# EAGLE schematic Desain Hardware Fahmi Mashuri (EAGLE 9.5.2)
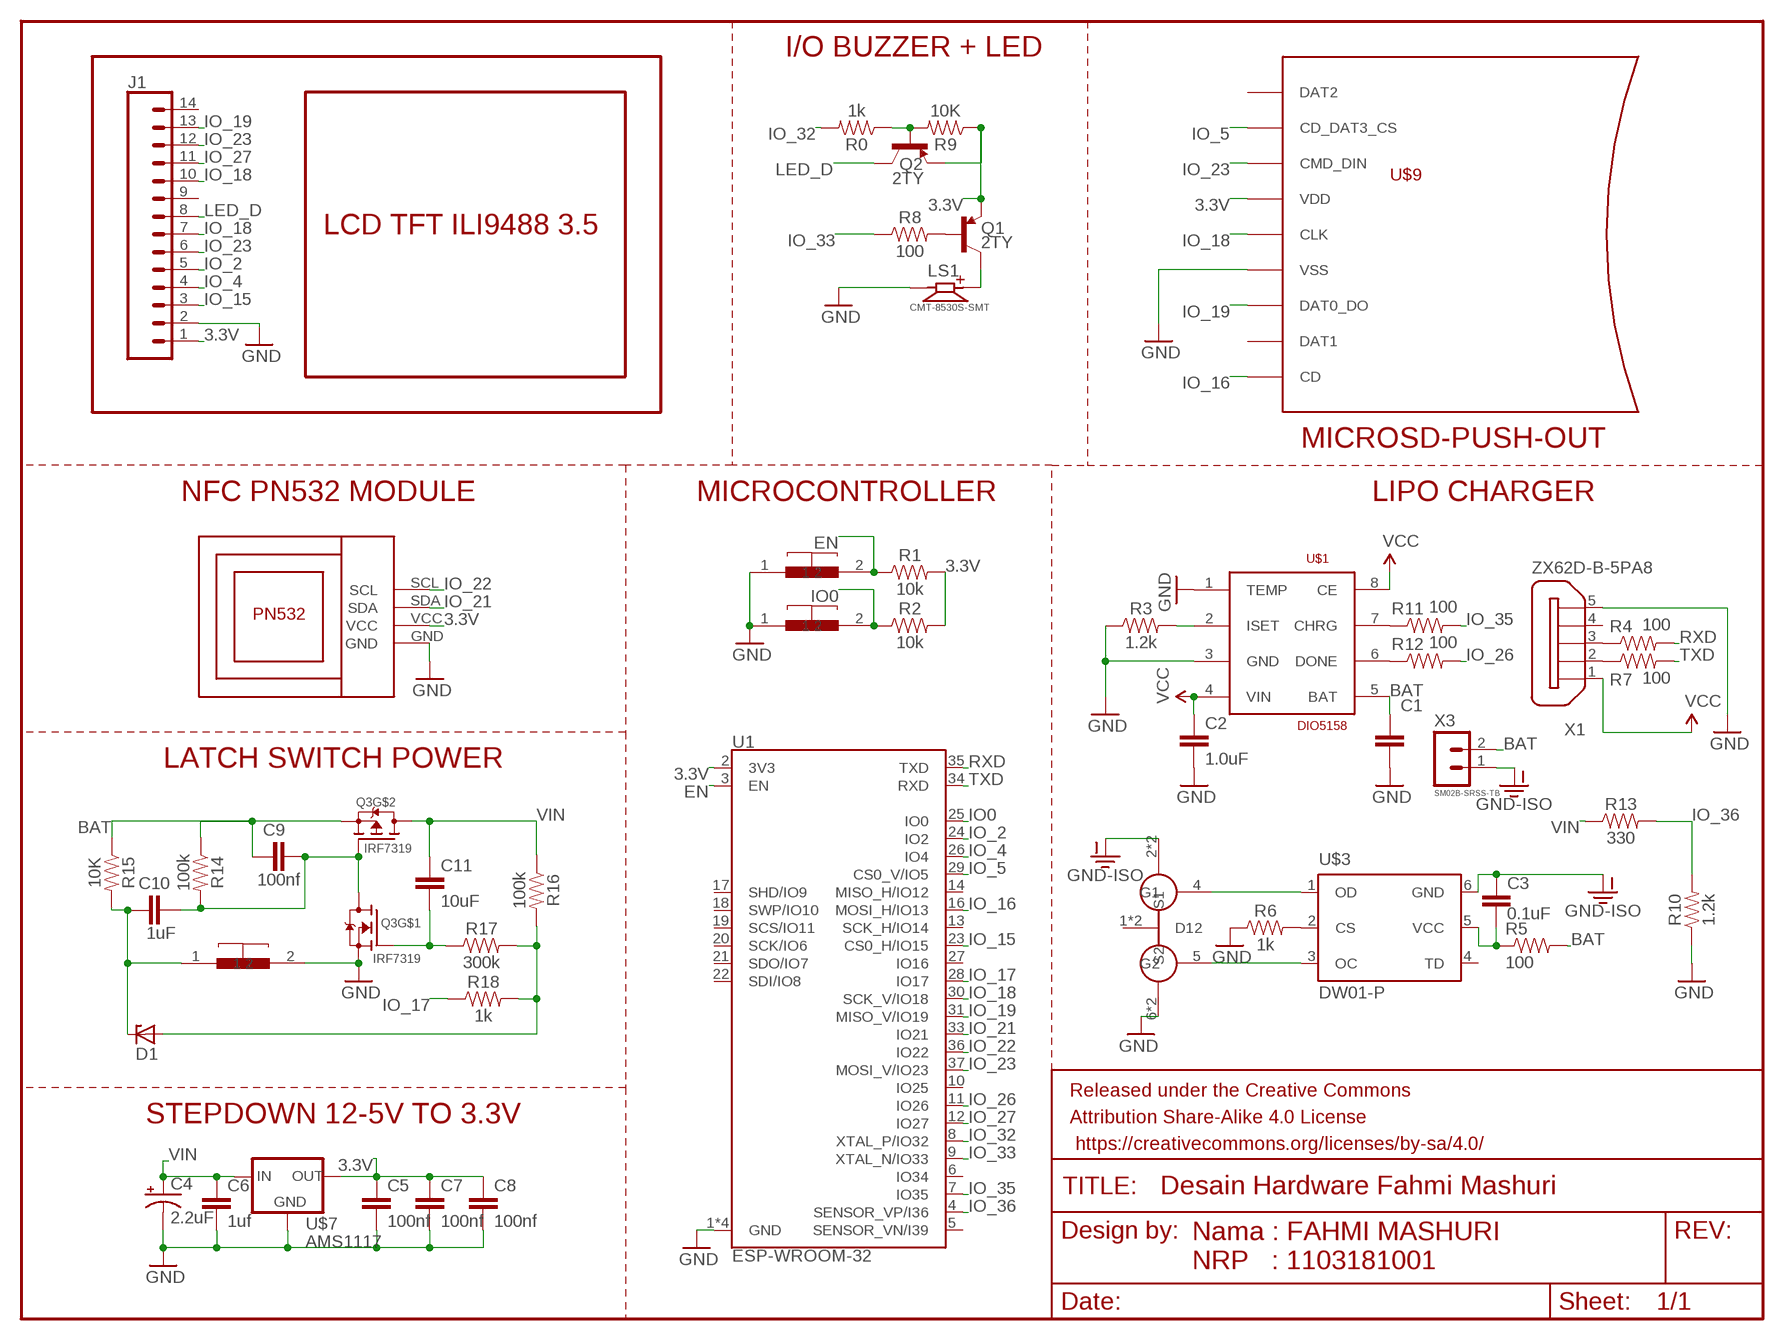
[diagram p0: schematic, sheet 1]

## Parts
C1  10uF  C-EUC0805K  [C0805K]
C2  1.0uF  1.0UF-0603-16V-10%  [0603]
C3  0.1uF  0.1UF-0603-25V-5%  [0603]
C4  2.2uF  68UF-POLAR-EIA3528-10V-10%(TANT)  [EIA3528]
C5  100nf  C-EUC0603K  [C0603K]
C6  1uf  C-EUC0805K  [C0805K]
C7  100nf  C-EUC0603K  [C0603K]
C8  100nf  C-EUC0603K  [C0603K]
C9  100nf  C-EUC0603K  [C0603K]
C10  1uF  C-EUC0603K  [C0603K]
C11  10uF  C-EUC0603K  [C0603K]
D1  ZENER-DIODE-SOD-323  [SOD-323]
FRAME1  FRAME-LETTER  [CREATIVE_COMMONS]
J1  CONN_14  [1X14]
LS1  CMT-8530S-SMT  [CUI_CMT-8530S-SMT]
Q1  2TY  TRANS_PNP-PMBT3906|MMBT3906L  [SOT23-3]
Q2  2TY  TRANS_PNP-PMBT3906|MMBT3906L  [SOT23-3]
Q3  IRF7319  [SOIC127P600X175-8N]
R0  1k  1.2MOHM-0603-1/10W-1%  [0603]
R1  10k  1.2MOHM-0603-1/10W-1%  [0603]
R2  10k  1.2MOHM-0603-1/10W-1%  [0603]
R3  1.2k  2.49KOHM-0603-1/10W-1%  [0603]
R4  100  1.2MOHM-0603-1/10W-1%  [0603]
R5  100  RESISTOR0603-RES  [0603-RES]
R6  1k  1KOHM-0603-1/10W-1%  [0603]
R7  100  1.2MOHM-0603-1/10W-1%  [0603]
R8  100  1.2MOHM-0603-1/10W-1%  [0603]
R9  10K  1.2MOHM-0603-1/10W-1%  [0603]
R10  1.2k  2.49KOHM-0603-1/10W-1%  [0603]
R11  100  1.2MOHM-0603-1/10W-1%  [0603]
R12  100  1.2MOHM-0603-1/10W-1%  [0603]
R13  330  2.49KOHM-0603-1/10W-1%  [0603]
R14  100k  1.2MOHM-0603-1/10W-1%  [0603]
R15  10K  1.2MOHM-0603-1/10W-1%  [0603]
R16  100k  1.2MOHM-0603-1/10W-1%  [0603]
R17  300k  1.2MOHM-0603-1/10W-1%  [0603]
R18  1k  1.2MOHM-0603-1/10W-1%  [0603]
U1  ESP-WROOM-32  [ESP-WROOM-32]
U$1  DIO5158  [SOIC-8]
U$2  PN532_NFC  [PN532_NFC]
U$3  DW01-P  [SOT23-6L]
U$4  FS8205A  [TSSOP8]
U$5  PUSHBUTTOMICRO  [PUSHBUTTOMICRO]
U$6  PUSHBUTTOMICRO  [PUSHBUTTOMICRO]
U$7  AMS1117  V_REG_LD1117VXXLD1117-SMD  [SOT223]
U$8  PUSHBUTTOMICRO  [PUSHBUTTOMICRO]
U$9  MICROSD-PUSH-OUT  [MICROSD-PUSH-OUT]
X1  ZX62D-B-5PA8  [ZX62D-B-5PA8]
X3  SM02B-SRSS-TB  [SM02B-SRSS-TB]

## Nets
3.3V: C5.1 C7.1 C8.1 J1.1 Q1.2(E) Q2.2(E) R1.2 R2.2 R9.1 U1.2(3V3) U$2.VCC U$7.2(OUT) U$9.4(VDD)
BAT: C1.1 C9.1 Q3.3(S2) R5.2 R14.1 R15.1 U$1.5(BAT) X3.2
EN: R1.1 U1.3(EN) U$5.2
GND: C1.2 C2.2 C4.C(-) C5.2 C6.2 C7.2 C8.2 J1.2 LS1.N Q3.1(S1) R3.1 R6.1 R10.1 U1.1(GND) U1.15(GND) U1.38(GND) U1.GND U$1.1(TEMP) U$1.3(GND) U$2.GND U$4.6(S2) U$4.7(S2) U$5.1 U$6.1 U$7.1(GND) U$8.2 U$9.6(VSS) U$9.G1(VSS) U$9.G2(VSS) U$9.G3(VSS) U$9.G4(VSS) X1.5
GND-ISO: C3.1 U$3.6(GND) U$4.2(S1) U$4.3(S1) X3.1
IO0: R2.1 U1.25(IO0) U$6.2
IO_2: J1.5 U1.24(IO2)
IO_4: J1.4 U1.26(IO4)
IO_5: U1.29(CS0_V/IO5) U$9.2(CD_DAT3_CS)
IO_15: J1.3 U1.23(CS0_H/IO15)
IO_16: U1.16(MOSI_H/IO13) U$9.CD
IO_17: R18.1 U1.28(IO17)
IO_18: J1.7 J1.10 U1.30(SCK_V/IO18) U$9.5(CLK)
IO_19: J1.13 U1.31(MISO_V/IO19) U$9.7(DAT0_DO)
IO_21: U1.33(IO21) U$2.SDA
IO_22: U1.36(IO22) U$2.SCL
IO_23: J1.6 J1.12 U1.37(MOSI_V/IO23) U$9.3(CMD_DIN)
IO_26: R12.2 U1.11(IO26)
IO_27: J1.11 U1.12(IO27)
IO_32: R0.2 U1.8(XTAL_P/IO32)
IO_33: R8.1 U1.9(XTAL_N/IO33)
IO_35: R11.2 U1.7(IO35)
IO_36: R10.2 R13.2 U1.4(SENSOR_VP/I36)
LED_D: J1.8 Q2.3(C)
N$1: R6.2 U$3.2(CS)
N$2: U$3.3(OC) U$4.5(G2)
N$3: R3.2 U$1.2(ISET)
N$4: U$3.1(OD) U$4.4(G1)
N$5: R4.1 X1.3
N$6: R7.1 X1.2
N$7: LS1.P Q1.3(C)
N$8: Q1.1(B) R8.2
N$9: Q2.1(B) R0.1 R9.2
N$10: R11.1 U$1.7(CHRG)
N$11: R12.1 U$1.6(DONE)
N$12: D1.A R16.2 R17.2 R18.2
N$13: C11.2 Q3.2(G1) R17.1
N$14: C9.2 C10.2 Q3.4(G2) Q3.7(D1) Q3.8(D1) R14.2
N$15: C10.1 D1.C R15.2 U$8.1
RXD: R4.2 U1.35(TXD)
TXD: R7.2 U1.34(RXD)
VCC: C2.1 U$1.4(VIN) U$1.8(CE) X1.1
VCC-DW: C3.2 R5.1 U$3.5(VCC)
VIN: C4.A(+) C6.1 C11.1 Q3.5(D2) Q3.6(D2) R13.1 R16.1 U$7.3(IN)
Unconnected: J1.9 J1.14 U1.5(SENSOR_VN/I39) U1.6(IO34) U1.10(IO25) U1.13(SCK_H/IO14) U1.14(MISO_H/IO12) U1.17(SHD/IO9) U1.18(SWP/IO10) U1.19(SCS/IO11) U1.20(SCK/IO6) U1.21(SDO/IO7) U1.22(SDI/IO8) U1.27(IO16) U$3.4(TD) U$4.1(D12) U$4.8(D12) U$9.1(DAT2) U$9.8(DAT1) X1.4 X1.S1 X1.S2 X1.S3 X1.S4

## Notes on the sheet
- I/O BUZZER + LED
- LCD TFT ILI9488 3.5
- NFC PN532 MODULE | MICROCONTROLLER | LIPO CHARGER
- LATCH SWITCH POWER
- STEPDOWN 12-5V TO 3.3V

## Library data of the parts
C1 C5-C11 = rcl:C-EU: CAPACITOR, European symbol; SPICEPREFIX: C
C2 = SparkFun-Capacitors:1.0UF: 1µF ceramic capacitors A capacitor is a passive two-terminal electrical component used to store electrical energy temporarily in an electric field.; PROD_ID: CAP-00868
C3 = SparkFun-Capacitors:0.1UF: 0.1µF ceramic capacitors A capacitor is a passive two-terminal electrical component used to store electrical energy temporarily in an electric field.; PROD_ID: CAP-08604
C4 = SparkFun-Capacitors:68UF-POLAR: 68µF polarized capacitors A capacitor is a passive two-terminal electrical component used to store electrical energy temporarily in an electric field.; PROD_ID: CAP-10790; VALUE: 68uF
D1 = bt_diode:ZENER-DIODE: Generic Zener diode
FRAME1 = SparkFun-Aesthetics:FRAME-LETTER: Schematic Frame - Letter Standard 8.5x11 US Letter frame
J1 = SparkFun-Connectors:CONN_14: Multi connection point. Often used as Generic Header-pin footprint for 0.1 inch spaced/style header connections On any of the 0.1 inch spaced packages, you can populate with these: Break Away Headers - Straight <https://www.sparkfun.com/products/116> (PRT-00116) Break Away Male Headers - Right Angle <https://www.sparkfun.com/products/553> (PRT-00553) Female Headers <https://www.sparkfun.com/products/115> (PRT-00115) Break Away Headers - Machine Pin <https://www.sparkfun.com/products/117> (PRT-00117) Break Away Female Headers - Swiss Machine Pin <https://www.sparkfun.com/products/743> (PRT-00743) For SCREWTERMINALS and SPRING TERMINALS visit here: Screw Terimnals on SparkFun.com <https://www.sparkfun.com/search/results?term=Screw+Terminals> (5mm/3.5mm/2.54mm spacing) This device is also useful as a general connection point to wire up your design to another part of your project. Our various solder wires solder well into these plated through hole pads. Hook-Up Wire - Assortment (Stranded, 22 AWG) <https://www.sparkfun.com/products/11375> (PRT-11375) Hook-Up Wire - Assortment (Solid Core, 22 AWG) <https://www.sparkfun.com/products/11367> (PRT-11367) View the entire wire category on our website here <https://www.sparkfun.com/categories/141> Special notes: Molex polarized connector foot print use with SKU : PRT-08231 with associated crimp pins and housings. 1MM SMD Version SKU: PRT-10208 NOTES ON THE VARIANTS LOCK and LOCK_LONGPADS... This footprint was designed to help hold the alignment of a through-hole component (i.e. 6-pin header) while soldering it into place. You may notice that each hole has been shifted either up or down by 0.005 of an inch from it's more standard position (which is a perfectly straight line). This slight alteration caused the pins (the squares in the middle) to touch the edges of the holes. Because they are alternating, it causes a "brace" to hold the component in place. 0.005 has proven to be the perfect amount of "off-center" position when using our standard breakaway headers. Although looks a little odd when you look at the bare footprint, once you have a header in there, the alteration is very hard to notice. Also,if you push a header all the way into place, it is covered up entirely on the bottom side.
LS1 = Buzzer_SMD:CMT-8530S-SMT: 8.5 mm, 3.6 Vo-p, 90 dB, Surface Mount (SMT), Magnetic Audio Transducer Buzzer Check prices <https://pricing.snapeda.com/parts/CMT-8530S-SMT-TR/CUI%20Devices/view-part?ref=eda>; AVAILABILITY: Good; CUI_PURCHASE_URL: https://www.cuidevices.com/product/audio/buzzers/audio-transducers/cmt-8530s-smt-tr?utm_source=snapeda.com&utm_medium=referral&utm_campaign=snapedaBOM; DESCRIPTION: 8.5 mm, 3.6 Vo-p, 90 dB, Surface Mount (SMT), Magnetic Audio Transducer Buzzer; MF: CUI Devices; MP: CMT-8530S-SMT-TR; PACKAGE: CUI; PRICE: None; PURCHASE-URL: https://pricing.snapeda.com/search/part/CMT-8530S-SMT-TR/?ref=eda
Q1 Q2 = SparkFun-DiscreteSemi:TRANS_PNP: PNP transistor Current controlled devices typically used to amplify current or used as a switch. SparkFun Products: SparkFun Serial Enabled 16x2 LCD - Red on Black <https://www.sparkfun.com/products/9068> SparkFun Logomatic <https://www.sparkfun.com/products/12772>; PROD_ID: TRANS-08052; VALUE: 200mA/40V
Q3 = IRF7319:IRF7319: 30V Dual N- and P- Channel HEXFET Power MOSFET in a SO-8 package; AVAILABILITY: Unavailable; DESCRIPTION: Mosfet Array N and P-Channel 30V 2W Surface Mount 8-SO; MF: Infineon Technologies; MP: IRF7319; PACKAGE: SOIC-8 International Rectifier; PRICE: None
R0 R1 R2 R4 R7-R9 R11 R12 R14-R18 = SparkFun-Resistors:1.2MOHM: 1.2MΩ resistor A resistor is a passive two-terminal electrical component that implements electrical resistance as a circuit element. Resistors act to reduce current flow, and, at the same time, act to lower voltage levels within circuits. - Wikipedia; PROD_ID: RES-10055; VALUE: 1.2M
R3 R10 R13 = SparkFun-Resistors:2.49KOHM: 2.49kΩ resistor A resistor is a passive two-terminal electrical component that implements electrical resistance as a circuit element. Resistors act to reduce current flow, and, at the same time, act to lower voltage levels within circuits. - Wikipedia; PROD_ID: RES-09568; VALUE: 2.49k
R5 = SparkFun:RESISTOR: Resistor Basic schematic elements and footprints for 0603, 1206, and PTH resistors.
R6 = SparkFun-Resistors:1KOHM: 1kΩ resistor A resistor is a passive two-terminal electrical component that implements electrical resistance as a circuit element. Resistors act to reduce current flow, and, at the same time, act to lower voltage levels within circuits. - Wikipedia; PROD_ID: RES-07856
U1 = SparkFun-RF:ESP-WROOM-32; PROD_ID: IC-13849
U$1 = ERADIONICA:DIO5158
U$2 = PN532:PN532_NFC
U$3 = lipo:DW01-P: One Cell Lithium-ion/Polymer Battery Protection IC The DW01-P battery protection IC is designed to protect lithium-ion/polymer battery from damage or degrading the lifetime due to overcharge, overdischarge, and/or overcurrent for one-cell lithium-ion/polymer battery powered systems, such as cellular phones. The ultra-small package and less required external components make it ideal to integrate the DW01-P into the limited space of battery pack. The accurate ±50mV overcharging detection voltage ensures safe and full utilization charging. The very low standby current drains little current from the cell while in storage.
U$4 = SparkFun:FS8205A
U$5 U$6 U$8 = PUSHBUTTOMICRO:PUSHBUTTOMICRO
U$7 = SparkFun-IC-Power:V_REG_LD1117VXX: LD1117VXX voltage regulator. We carry the 3.3V version (COM-00526) in TO-220 package.; PROD_ID: VREG-13917
U$9 = microsd:MICROSD-PUSH-OUT: T-Flash Push-Out Micro SD Card Reader 14.75mm x 14.5mm SMD with external pins
X1 = zx62d-b-5pa8-oshpark_10:ZX62D-B-5PA8: Micro USB Type B Connector - Standard, Shell Through Hole Source: http://www.hirose.co.jp/cataloge_hp/ed_ZX_20140804.pdf; MF: Hirose; MPN: ZX62D-B-5PA8; OC_FARNELL: 2300438; OC_NEWARK: 69W0712
X3 = con-JST SH:SM02B-SRSS: JST SH series header 1.00mm pitch disconnectable crimp style connectors, horizontal (side entry type), 2 pins